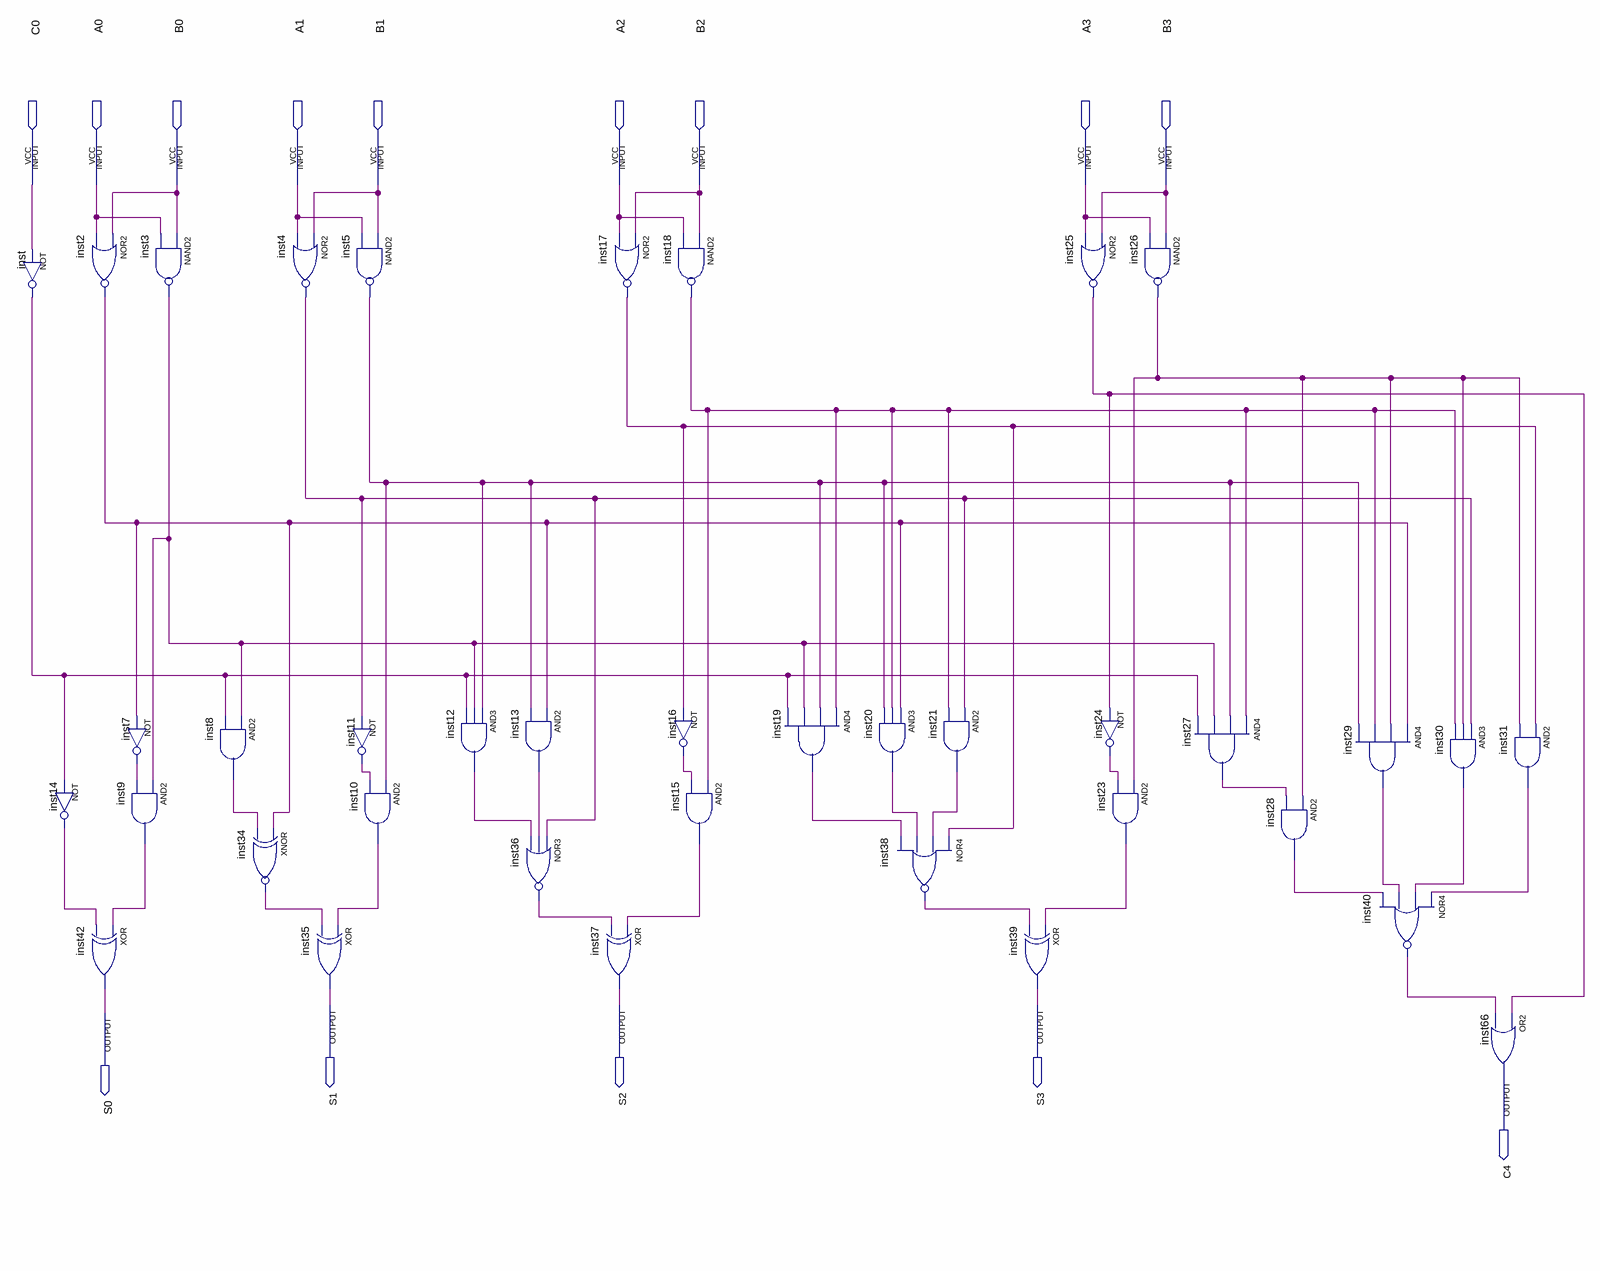
[diagram p0: schematic sheet]
// Quartus schematic CI7483.bdf as structural Verilog: 38 symbols, 14 pins
module CI7483 (
  input  C0,
  input  A0,
  input  B0,
  input  A1,
  input  B1,
  input  A2,
  input  B2,
  input  A3,
  input  B3,
  output S1,
  output S2,
  output S3,
  output S0,
  output C4
);

  wire inst2_out, inst3_out, inst4_out, inst5_out, inst7_out, inst8_out, inst9_out, inst10_out, inst11_out,
       inst12_out, inst13_out, inst14_out, inst15_out, inst16_out, inst17_out, inst18_out, inst19_out,
       inst20_out, inst21_out, inst23_out, inst24_out, inst25_out, inst26_out, inst27_out, inst28_out,
       inst29_out, inst30_out, inst31_out, inst34_out, inst36_out, inst38_out, inst40_out, inst_out;

  not inst (inst_out, C0);
  not inst14 (inst14_out, inst_out);
  nor inst2 (inst2_out, B0, A0);
  not inst7 (inst7_out, inst2_out);
  and inst9 (inst9_out, inst3_out, inst7_out);
  xor inst42 (S0, inst9_out, inst14_out);
  nand inst3 (inst3_out, B0, A0);
  and inst8 (inst8_out, inst3_out, inst_out);
  xnor inst34 (inst34_out, inst2_out, inst8_out);
  nor inst4 (inst4_out, B1, A1);
  xor inst35 (S1, inst10_out, inst34_out);
  nand inst5 (inst5_out, B1, A1);
  not inst11 (inst11_out, inst4_out);
  and inst10 (inst10_out, inst5_out, inst11_out);
  and inst12 (inst12_out, inst5_out, inst3_out, inst_out);
  and inst13 (inst13_out, inst2_out, inst5_out);
  nor inst36 (inst36_out, inst4_out, inst13_out, inst12_out);
  nor inst17 (inst17_out, B2, A2);
  xor inst37 (S2, inst15_out, inst36_out);
  nand inst18 (inst18_out, B2, A2);
  not inst16 (inst16_out, inst17_out);
  and inst15 (inst15_out, inst18_out, inst16_out);
  and inst19 (inst19_out, inst18_out, inst5_out, inst3_out, inst_out);
  and inst20 (inst20_out, inst2_out, inst18_out, inst5_out);
  nor inst38 (inst38_out, inst17_out, inst21_out, inst20_out, inst19_out);
  and inst21 (inst21_out, inst4_out, inst18_out);
  xor inst39 (S3, inst23_out, inst38_out);
  nor inst25 (inst25_out, B3, A3);
  not inst24 (inst24_out, inst25_out);
  and inst23 (inst23_out, inst26_out, inst24_out);
  nand inst26 (inst26_out, B3, A3);
  and inst27 (inst27_out, inst18_out, inst5_out, inst3_out, inst_out);
  and inst28 (inst28_out, inst26_out, inst27_out);
  and inst29 (inst29_out, inst2_out, inst26_out, inst18_out, inst5_out);
  nor inst40 (inst40_out, inst31_out, inst30_out, inst29_out, inst28_out);
  and inst30 (inst30_out, inst4_out, inst26_out, inst18_out);
  or inst66 (C4, inst25_out, inst40_out);
  and inst31 (inst31_out, inst17_out, inst26_out);
endmodule
